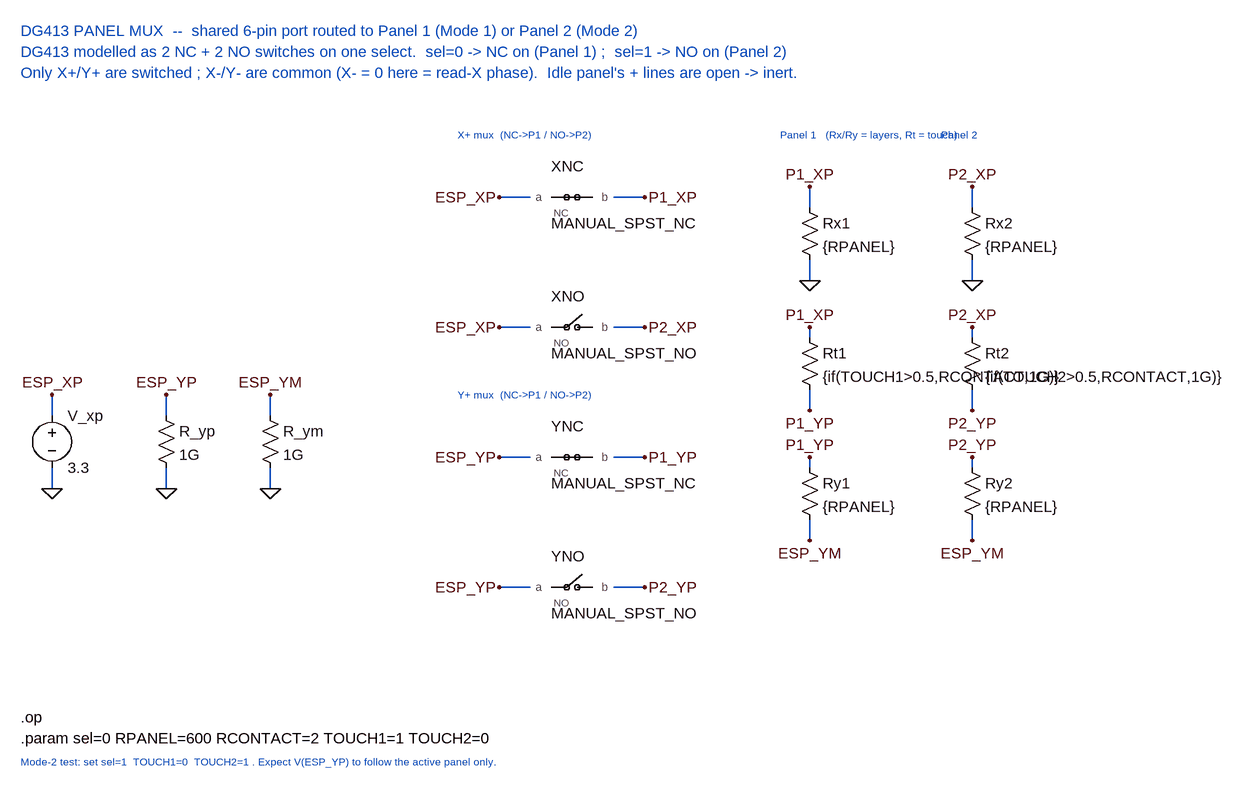
[diagram p0: schematic dg413_panel_mux.asc]
dg413_panel_mux.asc, the LTspice schematic file:
Version 4
SHEET 1 1700 1200
WIRE -400 384 -400 416
WIRE -400 496 -400 528
WIRE -224 384 -224 416
WIRE -224 496 -224 528
WIRE -64 384 -64 416
WIRE -64 496 -64 528
WIRE 336 80 288 80
WIRE 464 80 512 80
WIRE 336 280 288 280
WIRE 464 280 512 280
WIRE 336 480 288 480
WIRE 464 480 512 480
WIRE 336 680 288 680
WIRE 464 680 512 680
WIRE 766 64 766 96
WIRE 766 176 766 208
WIRE 766 280 766 296
WIRE 766 376 766 408
WIRE 766 480 766 496
WIRE 766 576 766 608
WIRE 1016 64 1016 96
WIRE 1016 176 1016 208
WIRE 1016 280 1016 296
WIRE 1016 376 1016 408
WIRE 1016 480 1016 496
WIRE 1016 576 1016 608
FLAG -400 384 ESP_XP
FLAG -400 528 0
FLAG -224 384 ESP_YP
FLAG -224 528 0
FLAG -64 384 ESP_YM
FLAG -64 528 0
FLAG 288 80 ESP_XP
FLAG 512 80 P1_XP
FLAG 288 280 ESP_XP
FLAG 512 280 P2_XP
FLAG 288 480 ESP_YP
FLAG 512 480 P1_YP
FLAG 288 680 ESP_YP
FLAG 512 680 P2_YP
FLAG 766 64 P1_XP
FLAG 766 208 0
FLAG 766 280 P1_XP
FLAG 766 408 P1_YP
FLAG 766 480 P1_YP
FLAG 766 608 ESP_YM
FLAG 1016 64 P2_XP
FLAG 1016 208 0
FLAG 1016 280 P2_XP
FLAG 1016 408 P2_YP
FLAG 1016 480 P2_YP
FLAG 1016 608 ESP_YM
SYMBOL voltage -400 400 R0
WINDOW 123 0 0 Left 0
WINDOW 39 0 0 Left 0
SYMATTR InstName V_xp
SYMATTR Value 3.3
SYMBOL res -240 400 R0
SYMATTR InstName R_yp
SYMATTR Value 1G
SYMBOL res -80 400 R0
SYMATTR InstName R_ym
SYMATTR Value 1G
SYMBOL MANUAL_SPST_NC 400 80 R0
SYMATTR InstName XNC
SYMATTR SpiceLine STATE={sel}
SYMBOL MANUAL_SPST_NO 400 280 R0
SYMATTR InstName XNO
SYMATTR SpiceLine STATE={sel}
SYMBOL MANUAL_SPST_NC 400 480 R0
SYMATTR InstName YNC
SYMATTR SpiceLine STATE={sel}
SYMBOL MANUAL_SPST_NO 400 680 R0
SYMATTR InstName YNO
SYMATTR SpiceLine STATE={sel}
SYMBOL res 750 80 R0
SYMATTR InstName Rx1
SYMATTR Value {RPANEL}
SYMBOL res 750 280 R0
SYMATTR InstName Rt1
SYMATTR Value {if(TOUCH1>0.5,RCONTACT,1G)}
SYMBOL res 750 480 R0
SYMATTR InstName Ry1
SYMATTR Value {RPANEL}
SYMBOL res 1000 80 R0
SYMATTR InstName Rx2
SYMATTR Value {RPANEL}
SYMBOL res 1000 280 R0
SYMATTR InstName Rt2
SYMATTR Value {if(TOUCH2>0.5,RCONTACT,1G)}
SYMBOL res 1000 480 R0
SYMATTR InstName Ry2
SYMATTR Value {RPANEL}
TEXT -448 -176 Left 2 ;DG413 PANEL MUX  --  shared 6-pin port routed to Panel 1 (Mode 1) or Panel 2 (Mode 2)
TEXT -448 -144 Left 2 ;DG413 modelled as 2 NC + 2 NO switches on one select.  sel=0 -> NC on (Panel 1) ;  sel=1 -> NO on (Panel 2)
TEXT -448 -112 Left 2 ;Only X+/Y+ are switched ; X-/Y- are common (X- = 0 here = read-X phase).  Idle panel's + lines are open -> inert.
TEXT 224 -16 Left 1 ;X+ mux  (NC->P1 / NO->P2)
TEXT 224 384 Left 1 ;Y+ mux  (NC->P1 / NO->P2)
TEXT 720 -16 Left 1 ;Panel 1   (Rx/Ry = layers, Rt = touch)
TEXT 968 -16 Left 1 ;Panel 2
TEXT -448 880 Left 2 !.op
TEXT -448 912 Left 2 !.param sel=0 RPANEL=600 RCONTACT=2 TOUCH1=1 TOUCH2=0
TEXT -448 948 Left 1 ;Mode-2 test: set sel=1  TOUCH1=0  TOUCH2=1 . Expect V(ESP_YP) to follow the active panel only.

The netlist it stands for:
* dg413_panel_mux.asc
V_xp ESP_XP 0 3.3
R_yp ESP_YP 0 1G
R_ym ESP_YM 0 1G
XXNC ESP_XP P1_XP MANUAL_SPST_NC STATE={sel}  ; pins a b
XXNO ESP_XP P2_XP MANUAL_SPST_NO STATE={sel}  ; pins a b
XYNC ESP_YP P1_YP MANUAL_SPST_NC STATE={sel}  ; pins a b
XYNO ESP_YP P2_YP MANUAL_SPST_NO STATE={sel}  ; pins a b
Rx1 P1_XP 0 {RPANEL}
Rt1 P1_XP P1_YP {if(TOUCH1>0.5,RCONTACT,1G)}
Ry1 P1_YP ESP_YM {RPANEL}
Rx2 P2_XP 0 {RPANEL}
Rt2 P2_XP P2_YP {if(TOUCH2>0.5,RCONTACT,1G)}
Ry2 P2_YP ESP_YM {RPANEL}
* DG413 PANEL MUX  --  shared 6-pin port routed to Panel 1 (Mode 1) or Panel 2 (Mode 2)
* DG413 modelled as 2 NC + 2 NO switches on one select.  sel=0 -> NC on (Panel 1) ;  sel=1 -> NO on (Panel 2)
* Only X+/Y+ are switched ; X-/Y- are common (X- = 0 here = read-X phase).  Idle panel's + lines are open -> inert.
* X+ mux  (NC->P1 / NO->P2)
* Y+ mux  (NC->P1 / NO->P2)
* Panel 1   (Rx/Ry = layers, Rt = touch)
* Panel 2
.op
.param sel=0 RPANEL=600 RCONTACT=2 TOUCH1=1 TOUCH2=0
* Mode-2 test: set sel=1  TOUCH1=0  TOUCH2=1 . Expect V(ESP_YP) to follow the active panel only.
.lib ManualSwitch.lib
.backanno
.end